# Altium schematic sheet STM32F103最小系统板.SchDoc
size A4
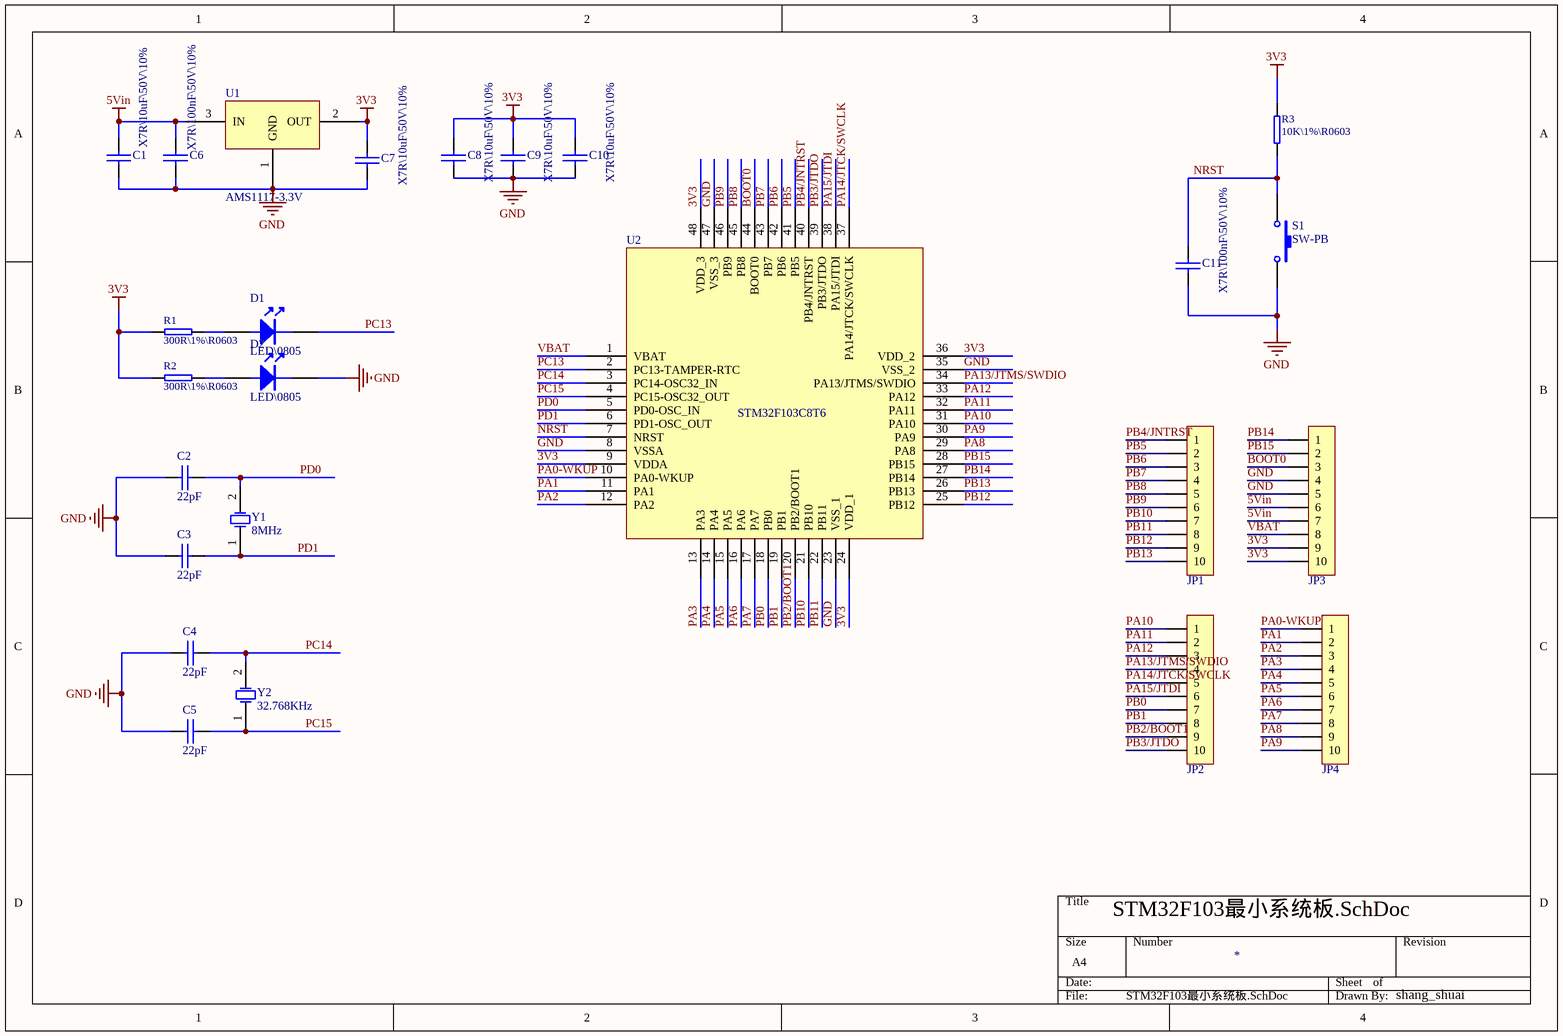
[diagram p0: STM32F103最小系统板.SchDoc]

## Parts
C1  X7R\10uF\50V\10%  [C0603]
C2  22pF  [C0603]
C3  22pF  [C0603]
C4  22pF  [C0603]
C5  22pF  [C0603]
C6  X7R\100nF\50V\10%  [C0603]
C7  X7R\10uF\50V\10%  [C0603]
C8  X7R\10uF\50V\10%  [C0603]
C9  X7R\10uF\50V\10%  [C0603]
C10  X7R\10uF\50V\10%  [C0603]
C11  X7R\100nF\50V\10%  [C0603]
D1  LED\0805  [LED 0805R]
D2  LED\0805  [LED 0805R]
JP1  HDR-1X10  [HDR2.54-LI-10P]  (value not drawn)
JP2  HDR-1X10  [HDR2.54-LI-10P]  (value not drawn)
JP3  HDR-1X10  [HDR2.54-LI-10P]  (value not drawn)
JP4  HDR-1X10  [HDR2.54-LI-10P]  (value not drawn)
R1  300R\1%\R0603  [R0603]
R2  300R\1%\R0603  [R0603]
R3  10K\1%\R0603  [R0603]
S1  SW-PB  [TSW SMD-3*6*4.3]
U1  AMS1117-3.3V  [SOT223_L]
U2  STM32F103C8T6  [LQFP48-7*7]
Y1  8MHz  [OSC HC-49S]
Y2  32.768KHz  [OSC-2x6-WI-B]

## Nets
3V3: C7.1 C8.1 C9.1 C10.1 JP3.9 JP3.10 R1.2 R2.2 R3.1 U1.2(OUT) U2.9(VDDA) U2.24(VDD_1) U2.36(VDD_2) U2.48(VDD_3)
5Vin: C1.1 C6.1 JP3.6 JP3.7 U1.3(IN)
GND: C1.2 C2.1 C3.1 C4.1 C5.1 C6.2 C7.2 C8.2 C9.2 C10.2 C11.2 D2.2 JP3.4 JP3.5 S1.2 U1.1(GND) U2.8(VSSA) U2.23(VSS_1) U2.35(VSS_2) U2.47(VSS_3)
BOOT0: JP3.3 U2.44(BOOT0)
NRST: C11.1 R3.2 S1.1 U2.7(NRST)
PA0-WKUP: JP4.1 U2.10(PA0-WKUP)
PA1: JP4.2 U2.11(PA1)
PA2: JP4.3 U2.12(PA2)
PA3: JP4.4 U2.13(PA3)
PA4: JP4.5 U2.14(PA4)
PA5: JP4.6 U2.15(PA5)
PA6: JP4.7 U2.16(PA6)
PA7: JP4.8 U2.17(PA7)
PA8: JP4.9 U2.29(PA8)
PA9: JP4.10 U2.30(PA9)
PA10: JP2.1 U2.31(PA10)
PA11: JP2.2 U2.32(PA11)
PA12: JP2.3 U2.33(PA12)
PA13/JTMS/SWDIO: JP2.4 U2.34(PA13/JTMS/SWDIO)
PA14/JTCK/SWCLK: JP2.5 U2.37(PA14/JTCK/SWCLK)
PA15/JTDI: JP2.6 U2.38(PA15/JTDI)
PB0: JP2.7 U2.18(PB0)
PB1: JP2.8 U2.19(PB1)
PB2/BOOT1: JP2.9 U2.20(PB2/BOOT1)
PB3/JTDO: JP2.10 U2.39(PB3/JTDO)
PB4/JNTRST: JP1.1 U2.40(PB4/JNTRST)
PB5: JP1.2 U2.41(PB5)
PB6: JP1.3 U2.42(PB6)
PB7: JP1.4 U2.43(PB7)
PB8: JP1.5 U2.45(PB8)
PB9: JP1.6 U2.46(PB9)
PB10: JP1.7 U2.21(PB10)
PB11: JP1.8 U2.22(PB11)
PB12: JP1.9 U2.25(PB12)
PB13: JP1.10 U2.26(PB13)
PB14: JP3.1 U2.27(PB14)
PB15: JP3.2 U2.28(PB15)
PC13: D1.2 U2.2(PC13-TAMPER-RTC)
PC14: C4.2 U2.3(PC14-OSC32_IN) Y2.2(OSC2)
PC15: C5.2 U2.4(PC15-OSC32_OUT) Y2.1(OSC1)
PD0: C2.2 U2.5(PD0-OSC_IN) Y1.2(OSC2)
PD1: C3.2 U2.6(PD1-OSC_OUT) Y1.1(OSC1)
VBAT: JP3.8 U2.1(VBAT)
NetD1_1: D1.1 R1.1
NetD2_1: D2.1 R2.1

## Notes on the sheet
- shang_shuai

## Library data of the parts
C1-C11 = C: Capacitor
D1 D2 = LED: 红色
JP1-JP4 = Header 10: 10P接插件; 版权归属: 源创客; BOM名称: 10P接插件; 学习资源: www.ooocke.com
R1-R3 = R: 电阻
S1 = SW-PB: Switch; Published: 24-Mar-1999; LatestRevisionDate: 17-Jul-2002; LatestRevisionNote: Re-released for DXP Platform.; PackageReference: SPST-2; Publisher: Altium Limited; PackageDescription: Switch; 2 Leads
U2 = STM32F103C8T6: 48PIN
Y1 Y2 = XTAL: 2脚无源脚晶振; Published: 8-Jun-2000; LatestRevisionDate: 17-Jul-2002; LatestRevisionNote: Re-released for DXP Platform.; PackageReference: R38; Publisher: Altium Limited; PackageDescription: Crystal, Thru-Hole; 2 Leads; Body 3.1 x 8.2 mm (Dia.xH)